# Altium schematic sheet turn_on_delay.SchDoc
size A3
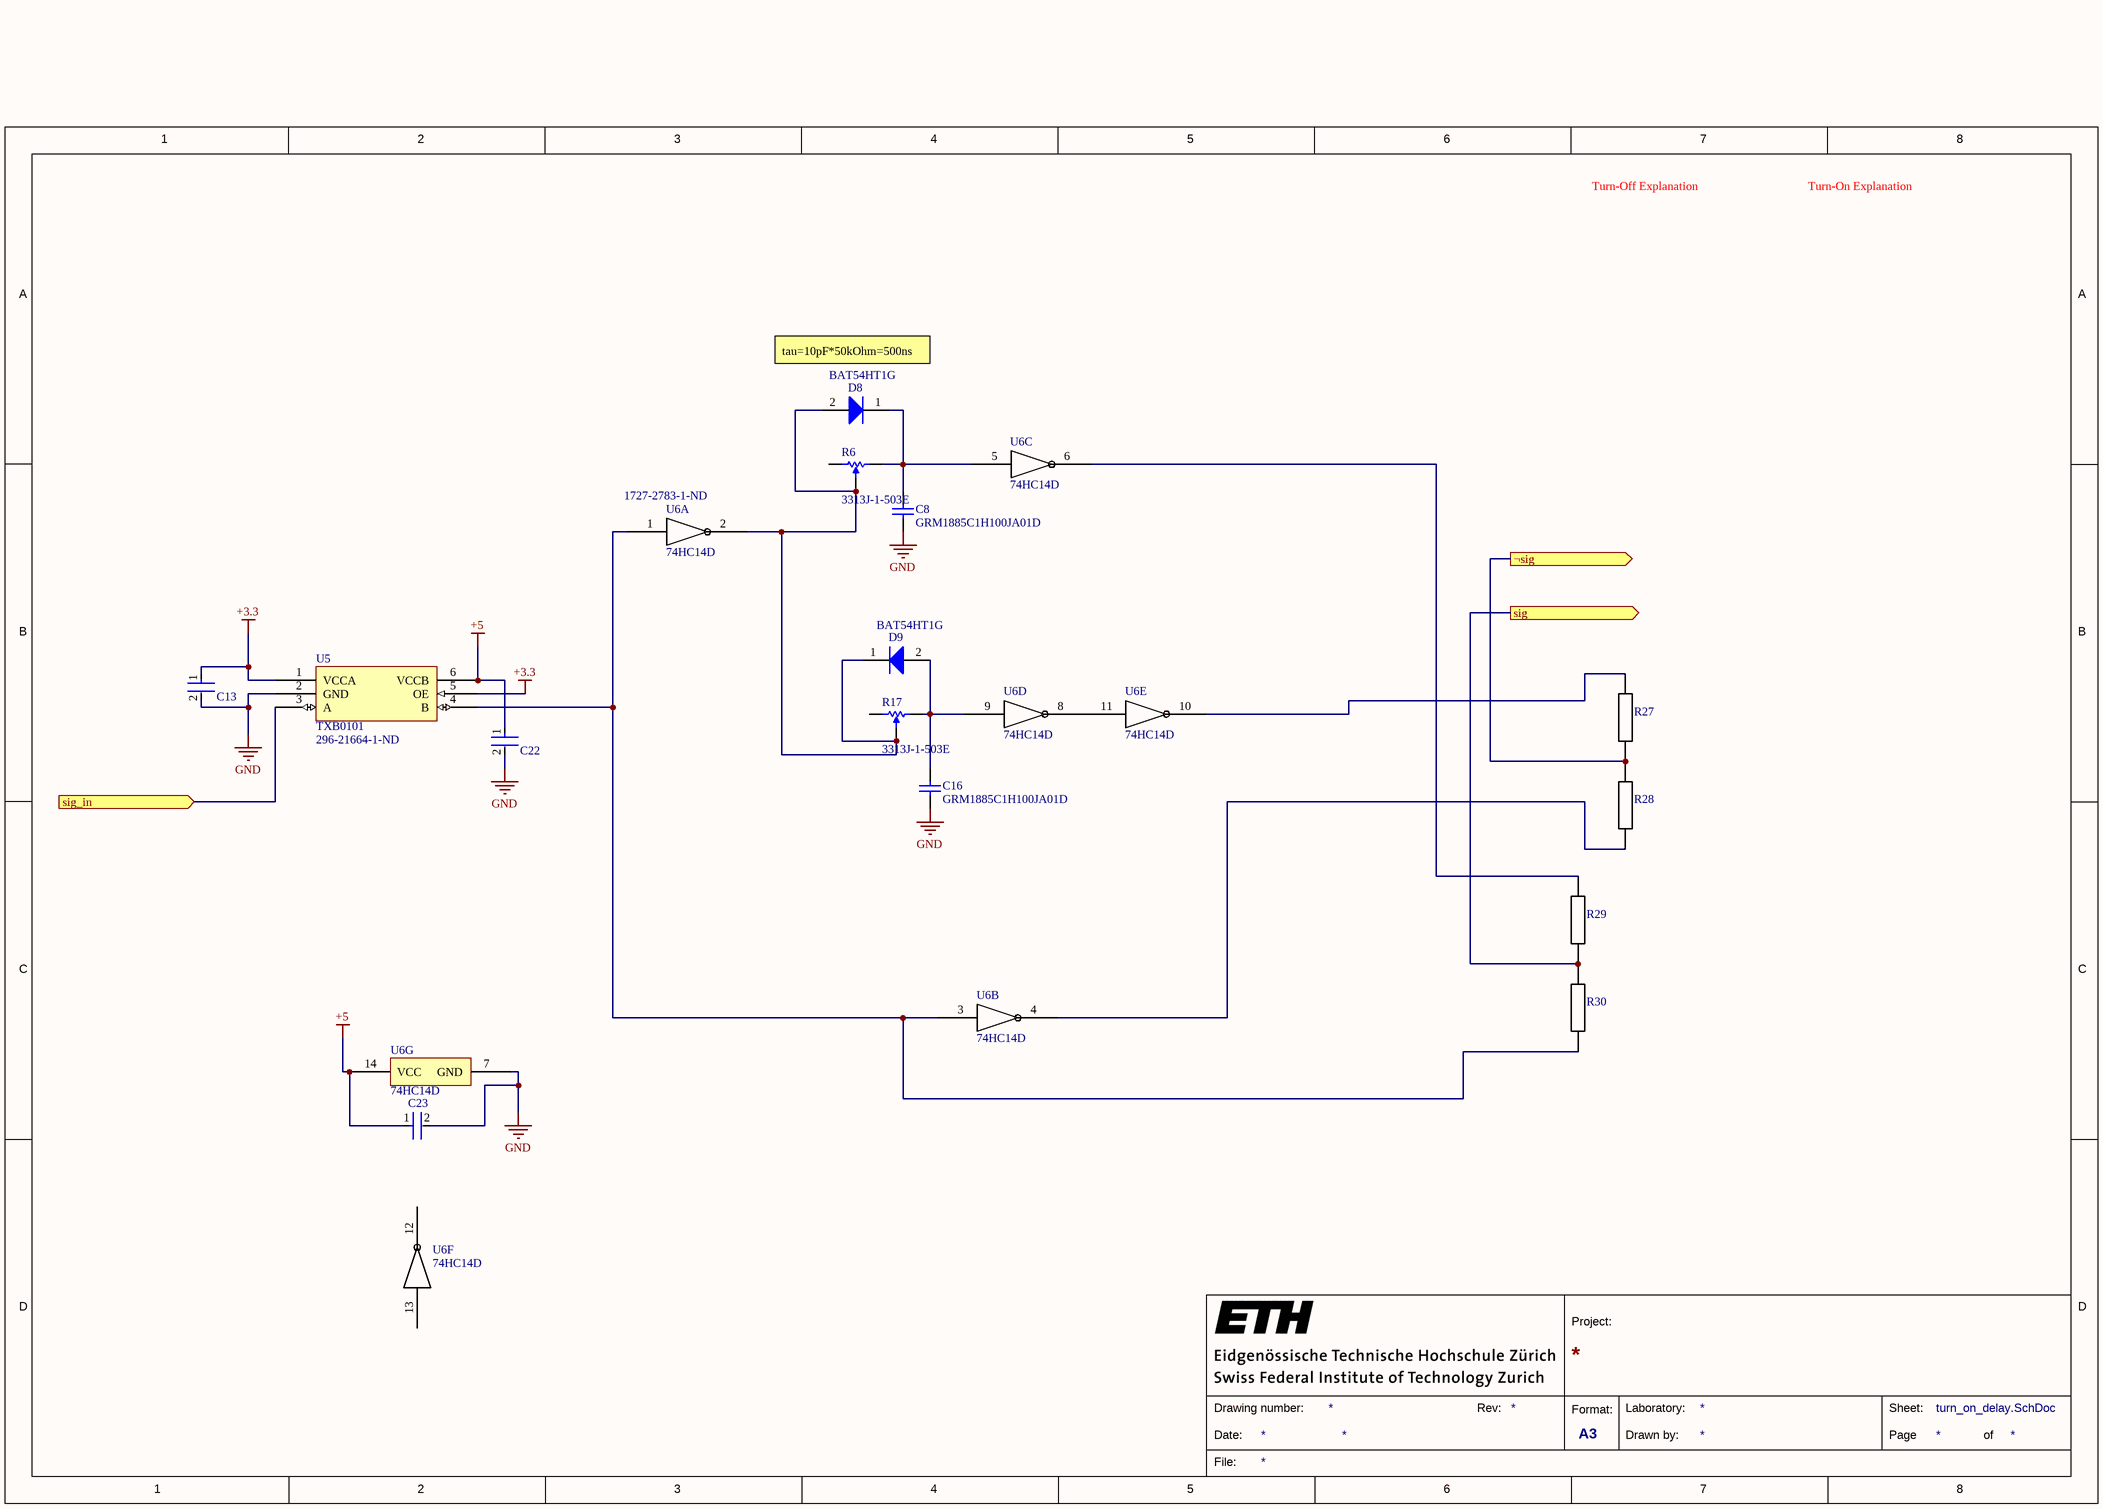
[diagram p0: turn_on_delay.SchDoc]

## Parts
C8  GRM1885C1H100JA01D  [CAPC1608X90X35LL10T15]
C13  C0603X104K5RACTU  [FP-C0603-CJ-MFG]  (value not drawn)
C16  GRM1885C1H100JA01D  [CAPC1608X90X35LL10T15]
C22  C0603X104K5RACTU  [FP-C0603-CJ-MFG]  (value not drawn)
C23  C0603X104K5RACTU  [FP-C0603-CJ-MFG]  (value not drawn)
D8  BAT54HT1G  [ONSC-SOD-323-2-477-02_V]
D9  BAT54HT1G  [ONSC-SOD-323-2-477-02_V]
R6  3313J-1-503E  [BOUR-3313J-1_V]
R17  3313J-1-503E  [BOUR-3313J-1_V]
R27  res_smd  [0805]  (value not drawn)
R28  res_smd  [0805]  (value not drawn)
R29  res_smd  [0805]  (value not drawn)
R30  res_smd  [0805]  (value not drawn)
U5  TXB0101  Supplier Part Number 1: 296-21664-1-ND  [SOT-23-6]
U6  74HC14D  Supplier Part Number 1: 1727-2783-1-ND  [SOP14_narrow]  (parts A,B,C,D,E,F,G of 7)

## Ports
sig (out), sig_in (in), ¬sig (out)

## Nets
+3.3: C13.1 U5.1(VCCA) U5.5(OE)
+5: C22.1 C23.1 U5.6(VCCB) U6.14(VCC)
GND: C8.1 C13.2 C16.1 C22.2 C23.2 U5.2(GND) U6.7(GND)
sig: R29.2 R30.1 ; port sig
sig_in: U5.3(A) ; port sig_in
¬sig: R27.2 R28.1 ; port ¬sig
NetC8_2: C8.2 D8.1(K) R6.3 U6.5(3A)
NetC16_2: C16.2 D9.2(A) R17.3 U6.9(4A)
NetD8_2: D8.2(A) D9.1(K) R6.2 R17.2 U6.2(1Y)
NetR27_1: R27.1 U6.10(5Y)
NetR28_2: R28.2 U6.4(2Y)
NetR29_1: R29.1 U6.6(3Y)
NetR30_2: R30.2 U5.4(B) U6.1(1A) U6.3(2A)
NetU6_8: U6.8(4Y) U6.11(5A)

Not connected (* = marked no-connect by the designer): R6 1; R17 1; U6 12(6Y) 13(6A)

## Notes on the sheet
- Turn-Off Explanation
- Turn-On Explanation
- (near D8) tau=10pF*50kOhm=500ns
- 1
- 2
- 3
- 4
- 5
- 6
- 7
- 8
- A
- B
- C
- D
- Project:
- Date:
- Drawing number:
- Rev:
- Format:
- A3
- Drawn by:
- Laboratory:
- Page
- Sheet:
- of
- File:

## Library data of the parts
C8 C16 = CMP-2006-02592-1: Manufacturer: Murata; Part Number: GRM1885C1H100JA01D
C13 C22 C23 = CMP-2006-03300-2: CAP CER 0.1UF 50V X7R 0603; Manufacturer: Kemet; Capacitance: 100nF; Material: Ceramic; Tolerance: 10%; Value: 100nF; Temperature Coefficient: 15%; Temperature Range High: +125°C; Temperature Range Low: -55°C; Manufacturer Part Number: C0603X104K5RACTU; Voltage: 50V; ComponentLink2Description: Datasheet; RoHS: TRUE; ComponentLink2URL: https://content.kemet.com/datasheets/KEM_C1013_X7R_FT-CAP_SMD.pdf; Device Class L3: Ceramic Capacitors; Device Class L2: Capacitors; Package: C0603-CJ; Height: 0.95mm; Device Class L1: Passive Components; Temperature Characteristic: X7R; Lead Free: Yes; Digikey Description: CAP CER 0.1UF 50V X7R 0603; Automotive: No; Mouser Description: Capacitor; Ceramic; Cap 0.1uF; Tol+10%; SMT; Flexible Termination; Vol-Rtg 50V; TR; Temperature: -55°C to +125°C; Octopart: https://octopart.com/c0603x104k5ractu-kemet-9145062; Category: Cap; Voltage Rating: 50V; Ipc Land Pattern Name: CAPC16080X80
D8 D9 = CMP-1055-00462-1: Schottky Barrier Diode, 2-Pin SOD-323, Pb-Free, Tape and Reel; Manufacturer: On Semiconductor; Configuration: Single; trr Max (ns): 5; IFSM Max (A): 0.6; ComponentLink3URL: http://www.onsemi.com/pub_link/Collateral/477-02.PDF.1; PackageDescription: 2-Pin SOD, Body 1.7 x 1.25 mm; ComponentLink2URL: http://www.onsemi.cn/pub_link/Collateral/BAT54HT1-D.PDF; ComponentLink3Description: Package Specification; ComponentLink2Description: Datasheet; DatasheetVersion: Rev. 6; PackageReference: SOD-323-2-477-02; RoHS: TRUE; ComponentLink1URL: http://www.onsemi.com/; Packing: Tape and Reel; PartNumber: BAT54HT1G; Mounting Technology: Surface Mount; ComponentLink1Description: Manufacturer URL; PackageVersion: Rev. H, 03/2007
R6 R17 = CMP-2000-05588-1: 3 mm Trimpot(R) Trimming Potentiometer, 50 KOhm, +/- 20%, 0.125 W, -55 to 125 degC, 3-Pin SMD, RoHS, Tape and Reel; Manufacturer: Bourns; SVHC: NoSVHC(19-Dec-2012); Temperature Coefficient: ±150ppm/°C; No. of Turns: 1; Power Rating: 125mW; Track Resistance: 50kohm; Manufacturer URL: http://www.bourns.com/; Potentiometer Mounting: SMD; Package Description: 3-Pin Surface Mount Device, Body 3.5 x 3.2 mm, Pitch 1.15 mm; Package Reference: 3313J-1; Mounting Technology: SurfaceMount; Resistance Tolerance: ±20%; Datasheet Version: 05/2016; Datasheet URL: http://www.bourns.com/docs/Product-Datasheets/3313.pdf
U5 = TXB0101: Level Shift IC [1.2V...3.6V] -> [1.65V...5.5V]; Supplier 1: Digi-Key
U6 = 74HC14D: Supplier 1: Digi-Key